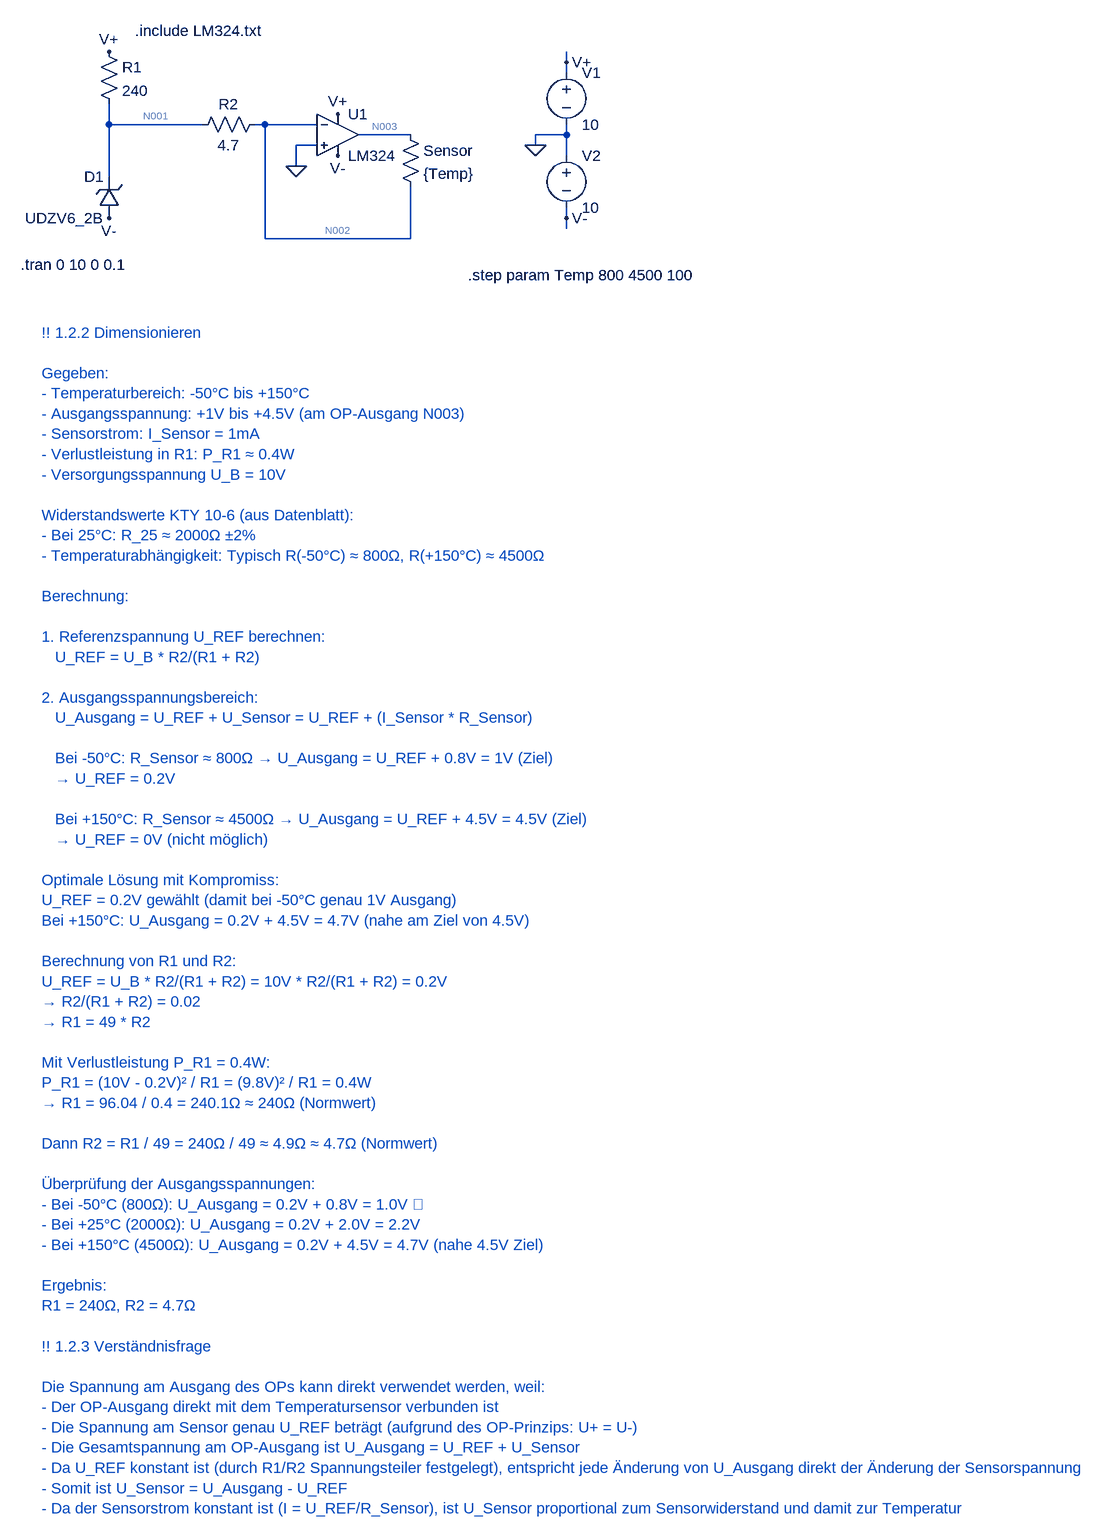
[diagram p0: schematic quelle.asc]
quelle.asc, the LTspice schematic file:
Version 4.1
SHEET 1 1460 2088
WIRE 512 32 512 16
WIRE 512 48 512 32
WIRE -192 128 -192 96
WIRE -48 128 -192 128
WIRE 48 128 32 128
WIRE 128 128 48 128
WIRE 272 144 192 144
WIRE 512 144 512 128
WIRE 512 144 464 144
WIRE 128 160 96 160
WIRE 464 160 464 144
WIRE 512 176 512 144
WIRE 96 192 96 160
WIRE -192 208 -192 128
WIRE 512 272 512 256
WIRE 512 288 512 272
WIRE 48 304 48 128
WIRE 272 304 272 224
WIRE 272 304 48 304
FLAG 464 160 0
FLAG 512 32 V+
FLAG 512 272 V-
FLAG 160 112 V+
FLAG 160 176 V-
FLAG 96 192 0
FLAG -192 16 V+
FLAG -192 272 V-
SYMBOL voltage 512 32 R0
WINDOW 123 0 0 Left 2
WINDOW 39 0 0 Left 2
SYMATTR InstName V1
SYMATTR Value 10
SYMBOL voltage 512 160 R0
WINDOW 123 0 0 Left 2
WINDOW 39 0 0 Left 2
SYMATTR InstName V2
SYMATTR Value 10
SYMBOL Opamps\\opamp2 160 80 R0
SYMATTR InstName U1
SYMATTR Value LM324
SYMBOL res 256 128 R0
SYMATTR InstName Sensor
SYMATTR Value {Temp}
SYMATTR SpiceLine tol=5
SYMBOL res -208 0 R0
SYMATTR InstName R1
SYMATTR Value 240
SYMATTR SpiceLine tol=5
SYMBOL res 48 112 R90
WINDOW 0 0 56 VBottom 2
WINDOW 3 32 56 VTop 2
SYMATTR InstName R2
SYMATTR Value 4.7
SYMATTR SpiceLine tol=5
SYMBOL zener -176 272 R180
WINDOW 0 24 64 Left 2
WINDOW 3 24 0 Left 2
SYMATTR InstName D1
SYMATTR Value UDZV6_2B
SYMATTR Description Diode
SYMATTR Type diode
TEXT -152 -16 Left 2 !.include LM324.txt
TEXT -328 344 Left 2 !.tran 0 10 0 0.1
TEXT -296 448 Left 2 ;!! 1.2.2 Dimensionieren\n \nGegeben:\n- Temperaturbereich: -50°C bis +150°C\n- Ausgangsspannung: +1V bis +4.5V (am OP-Ausgang N003)\n- Sensorstrom: I_Sensor = 1mA\n- Verlustleistung in R1: P_R1 ≈ 0.4W\n- Versorgungsspannung U_B = 10V\n \nWiderstandswerte KTY 10-6 (aus Datenblatt):\n- Bei 25°C: R_25 ≈ 2000Ω ±2%\n- Temperaturabhängigkeit: Typisch R(-50°C) ≈ 800Ω, R(+150°C) ≈ 4500Ω\n \nBerechnung:\n \n1. Referenzspannung U_REF berechnen:\n   U_REF = U_B * R2/(R1 + R2)\n \n2. Ausgangsspannungsbereich:\n   U_Ausgang = U_REF + U_Sensor = U_REF + (I_Sensor * R_Sensor)\n   \n   Bei -50°C: R_Sensor ≈ 800Ω → U_Ausgang = U_REF + 0.8V = 1V (Ziel)\n   → U_REF = 0.2V\n   \n   Bei +150°C: R_Sensor ≈ 4500Ω → U_Ausgang = U_REF + 4.5V = 4.5V (Ziel)\n   → U_REF = 0V (nicht möglich)\n \nOptimale Lösung mit Kompromiss:\nU_REF = 0.2V gewählt (damit bei -50°C genau 1V Ausgang)\nBei +150°C: U_Ausgang = 0.2V + 4.5V = 4.7V (nahe am Ziel von 4.5V)\n \nBerechnung von R1 und R2:\nU_REF = U_B * R2/(R1 + R2) = 10V * R2/(R1 + R2) = 0.2V\n→ R2/(R1 + R2) = 0.02\n→ R1 = 49 * R2\n \nMit Verlustleistung P_R1 = 0.4W:\nP_R1 = (10V - 0.2V)² / R1 = (9.8V)² / R1 = 0.4W\n→ R1 = 96.04 / 0.4 = 240.1Ω ≈ 240Ω (Normwert)\n \nDann R2 = R1 / 49 = 240Ω / 49 ≈ 4.9Ω ≈ 4.7Ω (Normwert)\n \nÜberprüfung der Ausgangsspannungen:\n- Bei -50°C (800Ω): U_Ausgang = 0.2V + 0.8V = 1.0V ✓\n- Bei +25°C (2000Ω): U_Ausgang = 0.2V + 2.0V = 2.2V\n- Bei +150°C (4500Ω): U_Ausgang = 0.2V + 4.5V = 4.7V (nahe 4.5V Ziel)\n \nErgebnis:\nR1 = 240Ω, R2 = 4.7Ω\n \n!! 1.2.3 Verständnisfrage\n \nDie Spannung am Ausgang des OPs kann direkt verwendet werden, weil:\n- Der OP-Ausgang direkt mit dem Temperatursensor verbunden ist\n- Die Spannung am Sensor genau U_REF beträgt (aufgrund des OP-Prinzips: U+ = U-)\n- Die Gesamtspannung am OP-Ausgang ist U_Ausgang = U_REF + U_Sensor\n- Da U_REF konstant ist (durch R1/R2 Spannungsteiler festgelegt), entspricht jede Änderung von U_Ausgang direkt der Änderung der Sensorspannung\n- Somit ist U_Sensor = U_Ausgang - U_REF\n- Da der Sensorstrom konstant ist (I = U_REF/R_Sensor), ist U_Sensor proportional zum Sensorwiderstand und damit zur Temperatur
TEXT 360 360 Left 2 !.step param Temp 800 4500 100

The netlist it stands for:
* quelle.asc
V1 V+ 0 10
V2 0 V- 10
X§U1 0 N002 V+ V- N003 LM324  ; pins In+ In- V+ V- OUT
R§Sensor N003 N002 {Temp} tol=5
R1 V+ N001 240 tol=5
R2 N002 N001 4.7 tol=5
D1 V- N001 UDZV6_2B
.model D D
.lib standard.dio
.include LM324.txt
.tran 0 10 0 0.1
* !! 1.2.2 Dimensionieren
* Gegeben:
* - Temperaturbereich: -50°C bis +150°C
* - Ausgangsspannung: +1V bis +4.5V (am OP-Ausgang N003)
* - Sensorstrom: I_Sensor = 1mA
* - Verlustleistung in R1: P_R1 ≈ 0.4W
* - Versorgungsspannung U_B = 10V
* Widerstandswerte KTY 10-6 (aus Datenblatt):
* - Bei 25°C: R_25 ≈ 2000Ω ±2%
* - Temperaturabhängigkeit: Typisch R(-50°C) ≈ 800Ω, R(+150°C) ≈ 4500Ω
* Berechnung:
* 1. Referenzspannung U_REF berechnen:
*    U_REF = U_B * R2/(R1 + R2)
* 2. Ausgangsspannungsbereich:
*    U_Ausgang = U_REF + U_Sensor = U_REF + (I_Sensor * R_Sensor)
*    Bei -50°C: R_Sensor ≈ 800Ω → U_Ausgang = U_REF + 0.8V = 1V (Ziel)
*    → U_REF = 0.2V
*    Bei +150°C: R_Sensor ≈ 4500Ω → U_Ausgang = U_REF + 4.5V = 4.5V (Ziel)
*    → U_REF = 0V (nicht möglich)
* Optimale Lösung mit Kompromiss:
* U_REF = 0.2V gewählt (damit bei -50°C genau 1V Ausgang)
* Bei +150°C: U_Ausgang = 0.2V + 4.5V = 4.7V (nahe am Ziel von 4.5V)
* Berechnung von R1 und R2:
* U_REF = U_B * R2/(R1 + R2) = 10V * R2/(R1 + R2) = 0.2V
* → R2/(R1 + R2) = 0.02
* → R1 = 49 * R2
* Mit Verlustleistung P_R1 = 0.4W:
* P_R1 = (10V - 0.2V)² / R1 = (9.8V)² / R1 = 0.4W
* → R1 = 96.04 / 0.4 = 240.1Ω ≈ 240Ω (Normwert)
* Dann R2 = R1 / 49 = 240Ω / 49 ≈ 4.9Ω ≈ 4.7Ω (Normwert)
* Überprüfung der Ausgangsspannungen:
* - Bei -50°C (800Ω): U_Ausgang = 0.2V + 0.8V = 1.0V ✓
* - Bei +25°C (2000Ω): U_Ausgang = 0.2V + 2.0V = 2.2V
* - Bei +150°C (4500Ω): U_Ausgang = 0.2V + 4.5V = 4.7V (nahe 4.5V Ziel)
* Ergebnis:
* R1 = 240Ω, R2 = 4.7Ω
* !! 1.2.3 Verständnisfrage
* Die Spannung am Ausgang des OPs kann direkt verwendet werden, weil:
* - Der OP-Ausgang direkt mit dem Temperatursensor verbunden ist
* - Die Spannung am Sensor genau U_REF beträgt (aufgrund des OP-Prinzips: U+ = U-)
* - Die Gesamtspannung am OP-Ausgang ist U_Ausgang = U_REF + U_Sensor
* - Da U_REF konstant ist (durch R1/R2 Spannungsteiler festgelegt), entspricht jede Änderung von U_Ausgang direkt der Änderung der Sensorspannung
* - Somit ist U_Sensor = U_Ausgang - U_REF
* - Da der Sensorstrom konstant ist (I = U_REF/R_Sensor), ist U_Sensor proportional zum Sensorwiderstand und damit zur Temperatur
.step param Temp 800 4500 100
.backanno
.end

* Results of the author's LTspice run, read from the files saved beside the schematic
* Operating Point (first step), zero values left out:
*   V(v-) = -10 V
*   V(n003) = -8.762 V
*   V(n001) = -9.83 V
*   V(v+) = 10 V
*   V(n002) = -9.816 V
*   I(V1) = -2.029 A
*   I(R2) = 3.069 mA
*   I(R1) = 82.63 mA
*   I(Sensor) = 1.317 mA
*   I(V2) = -2.032 A
*   I(D1) = -85.7 mA
*   Ix(u1:1) = 3.021 mA
*   Ix(u1:2) = -1.752 mA
*   Ix(u1:3) = 1.946 A
*   Ix(u1:4) = -1.947 A
*   Ix(u1:5) = -1.317 mA
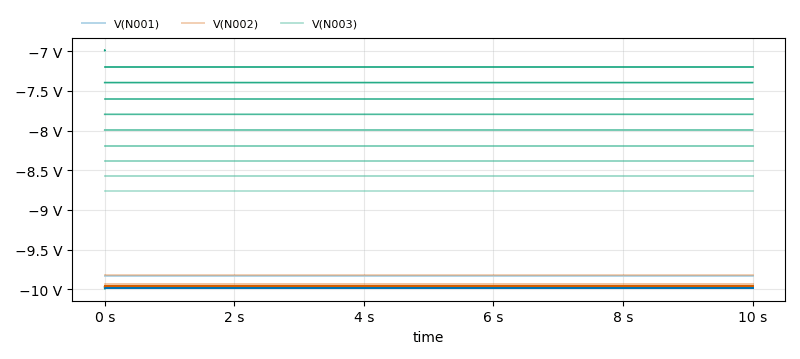
[diagram p1: Transient Analysis of quelle.asc, plotted from the saved traces]
* Transient Analysis, 10 runs:
*   V(N001) [temp=800°]: min -9.83 V, max -9.83 V, average -9.83 V, rms 9.83 V, last -9.83 V
*   V(N001) [temp=900°]: min -9.955 V, max -9.955 V, average -9.955 V, rms 9.955 V, last -9.955 V
*   V(N001) [temp=1000°]: min -9.973 V, max -9.973 V, average -9.973 V, rms 9.973 V, last -9.973 V
*   V(N001) [temp=1100°]: min -9.978 V, max -9.978 V, average -9.978 V, rms 9.978 V, last -9.978 V
*   V(N001) [temp=1200°]: min -9.98 V, max -9.98 V, average -9.98 V, rms 9.98 V, last -9.98 V
*   V(N001) [temp=1300°]: min -9.981 V, max -9.981 V, average -9.981 V, rms 9.981 V, last -9.981 V
*   V(N001) [temp=1400°]: min -9.981 V, max -9.981 V, average -9.981 V, rms 9.981 V, last -9.981 V
*   V(N001) [temp=1500°]: min -9.981 V, max -9.981 V, average -9.981 V, rms 9.981 V, last -9.981 V
*   V(N002) [temp=800°]: min -9.816 V, max -9.816 V, average -9.816 V, rms 9.816 V, last -9.816 V
*   V(N002) [temp=900°]: min -9.94 V, max -9.94 V, average -9.94 V, rms 9.94 V, last -9.94 V
*   V(N002) [temp=1000°]: min -9.957 V, max -9.957 V, average -9.957 V, rms 9.957 V, last -9.957 V
*   V(N002) [temp=1100°]: min -9.962 V, max -9.962 V, average -9.962 V, rms 9.962 V, last -9.962 V
*   V(N002) [temp=1200°]: min -9.964 V, max -9.964 V, average -9.964 V, rms 9.964 V, last -9.964 V
*   V(N002) [temp=1300°]: min -9.964 V, max -9.964 V, average -9.964 V, rms 9.964 V, last -9.964 V
*   V(N002) [temp=1400°]: min -9.965 V, max -9.965 V, average -9.965 V, rms 9.965 V, last -9.965 V
*   V(N002) [temp=1500°]: min -9.965 V, max -9.965 V, average -9.965 V, rms 9.965 V, last -9.965 V
*   V(N003) [temp=800°]: min -8.762 V, max -8.762 V, average -8.762 V, rms 8.762 V, last -8.762 V
*   V(N003) [temp=900°]: min -8.573 V, max -8.573 V, average -8.573 V, rms 8.573 V, last -8.573 V
*   V(N003) [temp=1000°]: min -8.382 V, max -8.382 V, average -8.382 V, rms 8.382 V, last -8.382 V
*   V(N003) [temp=1100°]: min -8.188 V, max -8.188 V, average -8.188 V, rms 8.188 V, last -8.188 V
*   V(N003) [temp=1200°]: min -7.992 V, max -7.992 V, average -7.992 V, rms 7.992 V, last -7.992 V
*   V(N003) [temp=1300°]: min -7.794 V, max -7.794 V, average -7.794 V, rms 7.794 V, last -7.794 V
*   V(N003) [temp=1400°]: min -7.595 V, max -7.595 V, average -7.595 V, rms 7.595 V, last -7.595 V
*   V(N003) [temp=1500°]: min -7.394 V, max -7.394 V, average -7.394 V, rms 7.394 V, last -7.394 V